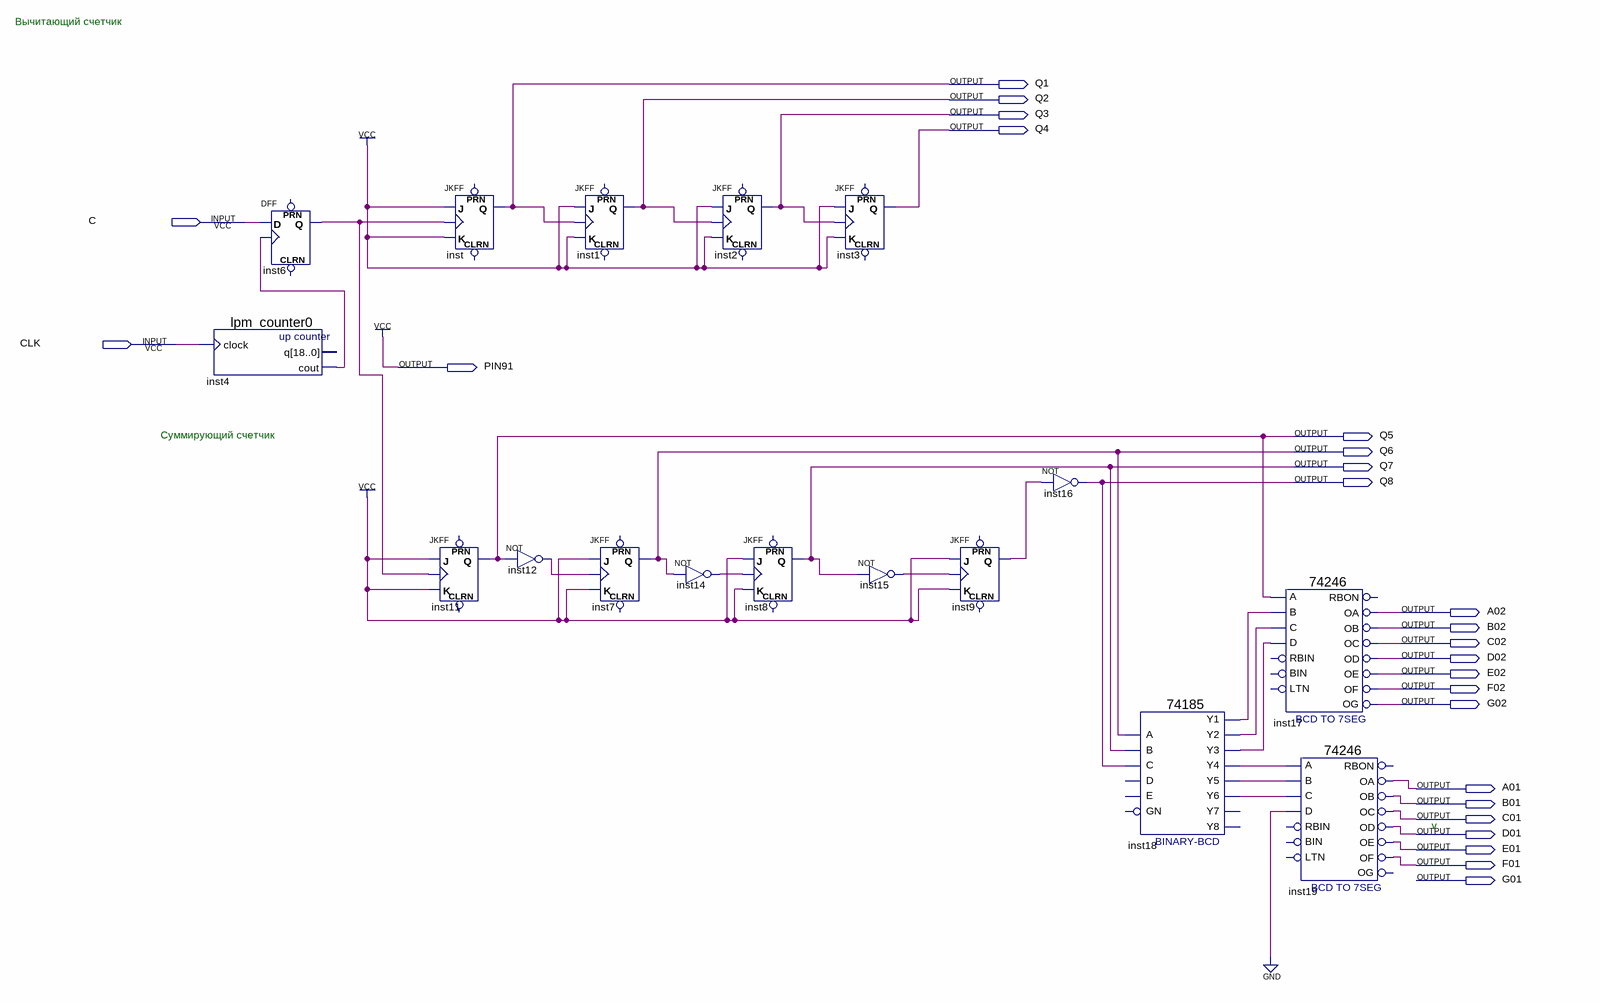
[diagram p0: schematic sheet]
// Quartus schematic Counters.bdf as structural Verilog: 17 symbols, 25 pins
module Counters (
  input  C,
  input  CLK,
  output Q1,
  output Q2,
  output Q3,
  output Q4,
  output PIN91,
  output Q5,
  output Q6,
  output Q7,
  output Q8,
  output A02,
  output B02,
  output C02,
  output D02,
  output E02,
  output F02,
  output G02,
  output A01,
  output B01,
  output C01,
  output D01,
  output E01,
  output F01,
  output G01
);

  wire inst4_cout, inst6_q, inst9_q, inst12_out, inst14_out, inst15_out, inst18_y1, inst18_y2, inst18_y3,
       inst18_y4, inst18_y5, inst18_y6;

  lpm_counter0 inst4 (.clock(CLK), .cout(inst4_cout));  // open: q
  DFF inst6 (.CLK(inst4_cout), .D(C), .Q(inst6_q));  // open: CLRN, PRN
  JKFF inst11 (.K(1'b1), .J(1'b1), .CLK(inst6_q), .Q(Q5));  // open: PRN, CLRN
  JKFF inst (.K(1'b1), .J(1'b1), .CLK(inst6_q), .Q(Q1));  // open: PRN, CLRN
  not inst12 (inst12_out, Q5);
  JKFF inst1 (.K(1'b1), .J(1'b1), .CLK(Q1), .Q(Q2));  // open: PRN, CLRN
  JKFF inst7 (.K(1'b1), .J(1'b1), .CLK(inst12_out), .Q(Q6));  // open: PRN, CLRN
  not inst14 (inst14_out, Q6);
  JKFF inst2 (.K(1'b1), .J(1'b1), .CLK(Q2), .Q(Q3));  // open: PRN, CLRN
  JKFF inst8 (.K(1'b1), .J(1'b1), .CLK(inst14_out), .Q(Q7));  // open: PRN, CLRN
  JKFF inst3 (.K(1'b1), .J(1'b1), .CLK(Q3), .Q(Q4));  // open: PRN, CLRN
  not inst15 (inst15_out, Q7);
  JKFF inst9 (.K(1'b1), .J(1'b1), .CLK(inst15_out), .Q(inst9_q));  // open: PRN, CLRN
  not inst16 (Q8, inst9_q);
  \74185  inst18 (
    .A(Q6), .B(Q7), .C(Q8), .Y1(inst18_y1), .Y3(inst18_y3), .Y2(inst18_y2), .Y5(inst18_y5), .Y4(inst18_y4),
    .Y6(inst18_y6));  // open: D, E, GN, Y8, Y7
  \74246  inst17 (
    .B(inst18_y1), .A(Q5), .D(inst18_y3), .C(inst18_y2), .OD(D02), .OC(C02), .OB(B02), .OE(E02), .OF(F02),
    .OA(A02), .OG(G02));  // open: RBIN, LTN, BIN, RBON
  \74246  inst19 (
    .B(inst18_y5), .A(inst18_y4), .D(1'b0), .C(inst18_y6), .OD(D01), .OC(C01), .OB(B01), .OE(E01), .OF(F01),
    .OA(A01));  // open: RBIN, LTN, BIN, RBON, OG

  assign PIN91 = 1'b1;

  // Notes on the sheet:
  //   Вычитающий счетчик
  //   Суммирующий счетчик
  //   v
endmodule
